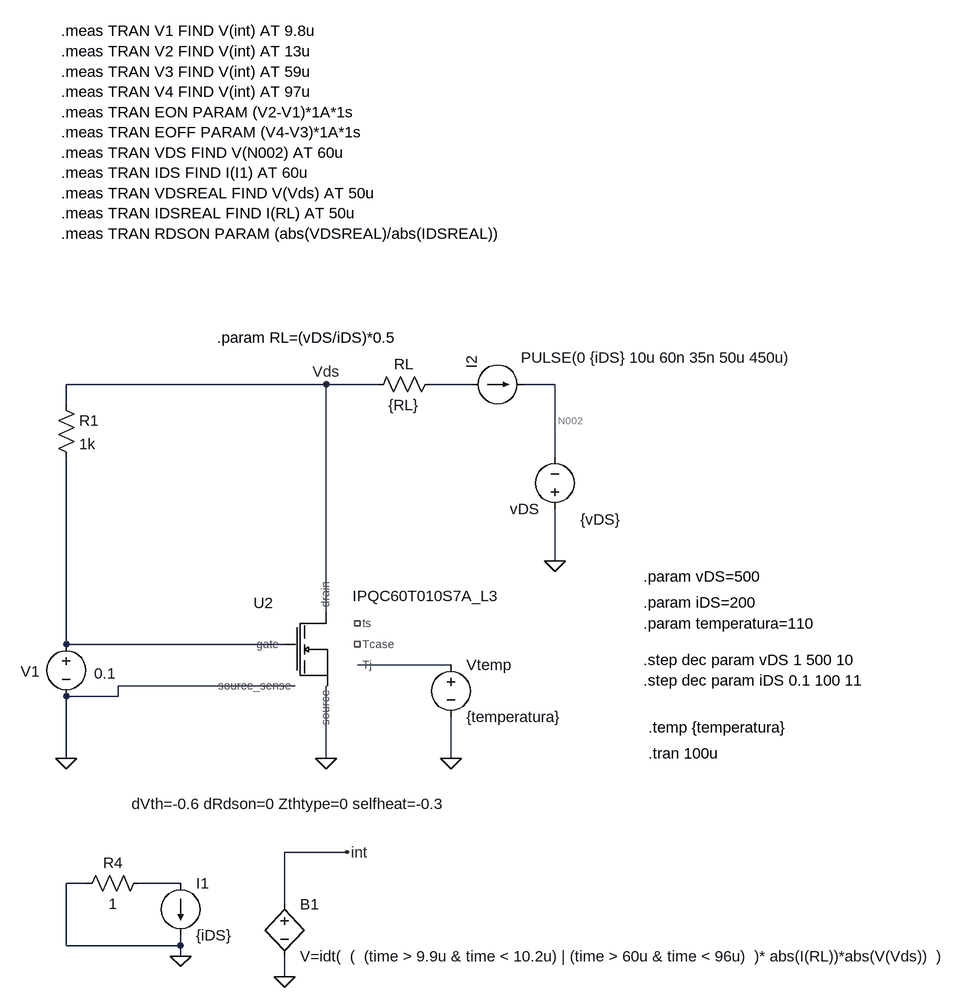
[diagram p0: schematic Eon_Eoff_circuit_reverse.asc]
Eon_Eoff_circuit_reverse.asc, the LTspice schematic file:
Version 4.1
SHEET 1 2248 980
WIRE 224 48 -176 48
WIRE 304 48 224 48
WIRE 448 48 384 48
WIRE 576 48 528 48
WIRE -176 80 -176 48
WIRE 576 160 576 48
WIRE 576 320 576 240
WIRE 224 400 224 48
WIRE -176 448 -176 160
WIRE 160 448 -176 448
WIRE 416 480 272 480
WIRE 176 512 -96 512
WIRE -96 528 -96 512
WIRE -96 528 -176 528
WIRE -176 624 -176 528
WIRE 224 624 224 512
WIRE 416 624 416 560
WIRE 256 768 160 768
WIRE -144 816 -176 816
WIRE 0 816 -64 816
WIRE 160 848 160 768
WIRE -176 912 -176 816
WIRE 0 912 0 896
WIRE 0 912 -176 912
WIRE 0 928 0 912
WIRE 160 960 160 928
FLAG 576 320 0
FLAG 160 960 0
FLAG 256 768 int
FLAG 0 928 0
FLAG 224 48 Vds
FLAG 224 624 0
FLAG -176 624 0
FLAG 416 624 0
SYMBOL voltage 576 256 R180
WINDOW 123 0 0 Left 0
WINDOW 39 0 0 Left 0
WINDOW 3 -101 0 Left 2
SYMATTR Value {vDS}
SYMATTR InstName vDS
SYMBOL res 400 32 R90
WINDOW 0 0 56 VBottom 2
WINDOW 3 32 56 VTop 2
SYMATTR InstName RL
SYMATTR Value {RL}
SYMBOL bv 160 832 R0
SYMATTR InstName B1
SYMATTR Value V=idt(  (  (time > 9.9u & time < 10.2u) | (time > 60u & time < 96u)  )* abs(I(RL))*abs(V(Vds))  )
SYMBOL current 0 816 R0
WINDOW 123 0 0 Left 0
WINDOW 39 0 0 Left 0
SYMATTR InstName I1
SYMATTR Value {iDS}
SYMBOL res -48 800 R90
WINDOW 0 0 56 VBottom 2
WINDOW 3 32 56 VTop 2
SYMATTR InstName R4
SYMATTR Value 1
SYMBOL voltage -176 432 R0
WINDOW 0 -70 58 Left 2
WINDOW 3 43 61 Left 2
WINDOW 123 0 0 Left 0
WINDOW 39 0 0 Left 0
SYMATTR InstName V1
SYMATTR Value 0.1
SYMBOL current 448 48 R270
WINDOW 123 0 0 Left 0
WINDOW 39 0 0 Left 0
WINDOW 3 41 76 VRight 2
SYMATTR Value PULSE(0 {iDS} 10u 60n 35n 50u 450u)
SYMATTR InstName I2
SYMBOL IPQC60T010S7_L3 224 464 R0
WINDOW 39 -56 214 Top 2
SYMATTR InstName U2
SYMATTR SpiceLine dVth=-0.6 dRdson=0 Zthtype=0 selfheat=-0.3
SYMBOL voltage 416 464 R0
WINDOW 123 0 0 Left 0
WINDOW 39 0 0 Left 0
SYMATTR InstName Vtemp
SYMATTR Value {temperatura}
SYMBOL res -192 64 R0
SYMATTR InstName R1
SYMATTR Value 1k
TEXT 56 -24 Left 2 !.param RL=(vDS/iDS)*0.5
TEXT 712 344 Left 2 !.param vDS=500
TEXT 712 384 Left 2 !.param iDS=200
TEXT 712 472 Left 2 !.step dec param vDS 1 500 10
TEXT 712 504 Left 2 !.step dec param iDS 0.1 100 11
TEXT 720 616 Left 2 !.tran 100u
TEXT -184 -496 Left 2 !.meas TRAN V1 FIND V(int) AT 9.8u\n.meas TRAN V2 FIND V(int) AT 13u\n.meas TRAN V3 FIND V(int) AT 59u\n.meas TRAN V4 FIND V(int) AT 97u\n.meas TRAN EON PARAM (V2-V1)*1A*1s\n.meas TRAN EOFF PARAM (V4-V3)*1A*1s\n.meas TRAN VDS FIND V(N002) AT 60u\n.meas TRAN IDS FIND I(I1) AT 60u\n.meas TRAN VDSREAL FIND V(Vds) AT 50u\n.meas TRAN IDSREAL FIND I(RL) AT 50u\n.meas TRAN RDSON PARAM (abs(VDSREAL)/abs(IDSREAL))
TEXT 720 576 Left 2 !.temp {temperatura}
TEXT 712 416 Left 2 !.param temperatura=110

The netlist it stands for:
* Eon_Eoff_circuit_reverse.asc
vDS 0 N002 {vDS}
RL N001 Vds {RL}
B1 int 0 V=idt(  (  (time > 9.9u & time < 10.2u) | (time > 60u & time < 96u)  )* abs(I(RL))*abs(V(Vds))  )
I1 N005 0 {iDS}
R4 N005 0 1
V1 N003 0 0.1
I2 N001 N002 PULSE(0 {iDS} 10u 60n 35n 50u 450u)
X§U2 Vds N003 0 0 NC_01 N004 NC_02 IPQC60T010S7A_L3 dVth=-0.6 dRdson=0 Zthtype=0 selfheat=-0.3  ; pins drain gate source source_sense ts Tj Tcase
Vtemp N004 0 {temperatura}
R1 Vds N003 1k
.param RL=(vDS/iDS)*0.5
.param vDS=500
.param iDS=200
.step dec param vDS 1 500 10
.step dec param iDS 0.1 100 11
.tran 100u
.meas TRAN V1 FIND V(int) AT 9.8u
.meas TRAN V2 FIND V(int) AT 13u
.meas TRAN V3 FIND V(int) AT 59u
.meas TRAN V4 FIND V(int) AT 97u
.meas TRAN EON PARAM (V2-V1)*1A*1s
.meas TRAN EOFF PARAM (V4-V3)*1A*1s
.meas TRAN VDS FIND V(N002) AT 60u
.meas TRAN IDS FIND I(I1) AT 60u
.meas TRAN VDSREAL FIND V(Vds) AT 50u
.meas TRAN IDSREAL FIND I(RL) AT 50u
.meas TRAN RDSON PARAM (abs(VDSREAL)/abs(IDSREAL))
.temp {temperatura}
.param temperatura=110
.lib IFX_S7A_TS_600V.lib
.backanno
.end